# EAGLE schematic Vibrator_driver-FSR (EAGLE 9.6.2)
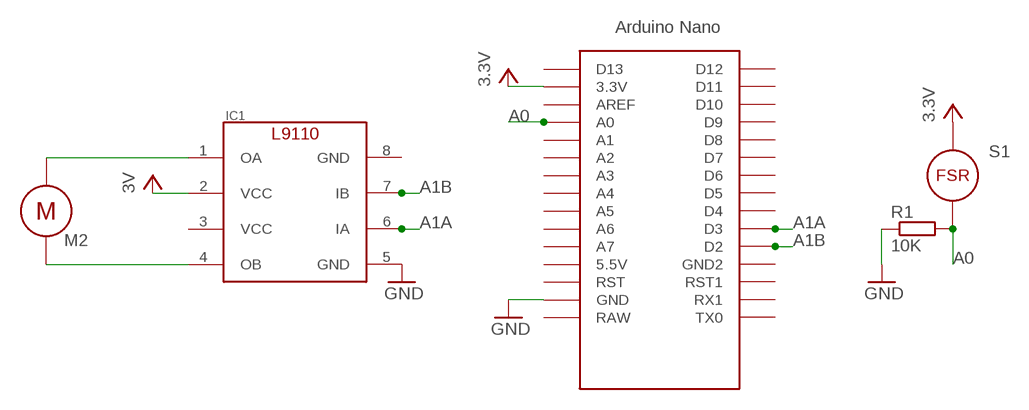
[diagram p0: schematic, sheet 1]

## Parts
IC1  L9110  [SO8P]
M2  308-100  [308-100]
R1  10K  R-EU_0204/7  [0204/7]
S1  308-100  [308-100]
U$1  NANO  [NANO]

## Nets
A0: R1.2 S1.NEG U$1.A0
A1A: IC1.6(IA) U$1.D3
A1B: IC1.7(IB) U$1.D2
GND: IC1.5(GND) R1.1 U$1.GND
N$1: IC1.1(OA) M2.POS
N$2: IC1.4(OB) M2.NEG
VCC: IC1.2(VCC) S1.POS U$1.3.3V ; supply symbol labelled 3.3V, 3V
Unconnected: IC1.3(VCC) IC1.8(GND) U$1.5V(5.5V) U$1.A1 U$1.A2 U$1.A3 U$1.A4 U$1.A5 U$1.A6 U$1.A7 U$1.AREF U$1.D4 U$1.D5 U$1.D6 U$1.D7 U$1.D8 U$1.D9 U$1.D10 U$1.D11 U$1.D12 U$1.D13 U$1.GND1(GND2) U$1.ICSP1 U$1.ICSP2 U$1.ICSP3 U$1.ICSP4 U$1.ICSP5 U$1.ICSP6 U$1.RAW U$1.RST U$1.RST1 U$1.RX1 U$1.TX0

## Library data of the parts
IC1 = FaBo-Motor:L9110
M2 = motor:308-100: Pico Vibe; PRECISION_MICRODRIVES: 308-100
R1 = rcl:R-EU_: RESISTOR, European symbol; SPICEPREFIX: R
S1 = fsr:308-100: Pico Vibe; PRECISION_MICRODRIVES: 308-100
U$1 = Arduino-clone:NANO: Arduino Nano